# EAGLE design sensor_tag (EAGLE 9.0.0)
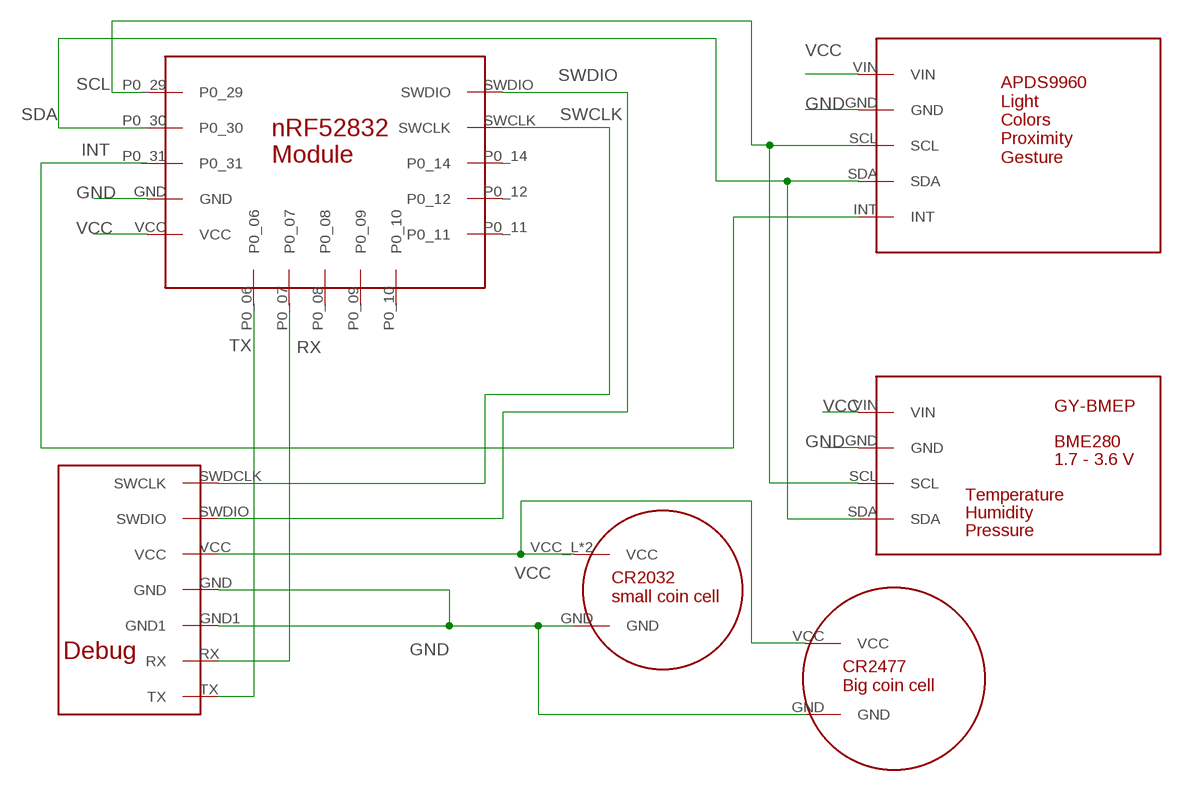
[diagram p0: schematic, sheet 1]

## Parts
U$1  GY-BMEPGY-BMEP-NOHOLE  [GY-BMEP-NOHOLE]
U$2  APDS9960_MODULEAPDS9960-FULL  [APDS9960-FULL]
U$3  NRF52832_MODULENRF52832_MOD_SMALL  [NRF52832_MOD_SMALL]
U$4  CR2032  [CR2032_SMD]
U$5  NRF_TAG_DEBUG  [NRF_TAG_DEBUG]
U$6  CR2477  [CR2477]

## Nets
GND: U$1.GND U$2.GND U$3.GND U$4.GND U$5.GND U$5.GND1 U$6.GND
INT: U$2.INT U$3.P0_31
RX: U$3.P0_07 U$5.RX
SCL: U$1.SCL U$2.SCL U$3.P0_29
SDA: U$1.SDA U$2.SDA U$3.P0_30
SWCLK: U$3.SWCLK U$5.SWDCLK(SWCLK)
SWDIO: U$3.SWDIO U$5.SWDIO
TX: U$3.P0_06 U$5.TX
VCC: U$1.VIN U$2.VIN U$3.VCC U$4.VCC_L(VCC) U$4.VCC_R(VCC) U$5.VCC U$6.VCC
Unconnected: U$3.P0_08 U$3.P0_09 U$3.P0_10 U$3.P0_11 U$3.P0_12 U$3.P0_14

## Library data of the parts
U$1 = GY-BMEP:GY-BMEP
U$2 = APDS9960:APDS9960_MODULE: This is the device for the APDS9960 module not the chip alone.
U$3 = nRF52832_module:NRF52832_MODULE
U$4 = cr2032:CR2032
U$5 = nrf_tag_debug:NRF_TAG_DEBUG
U$6 = cr2477:CR2477

## Board
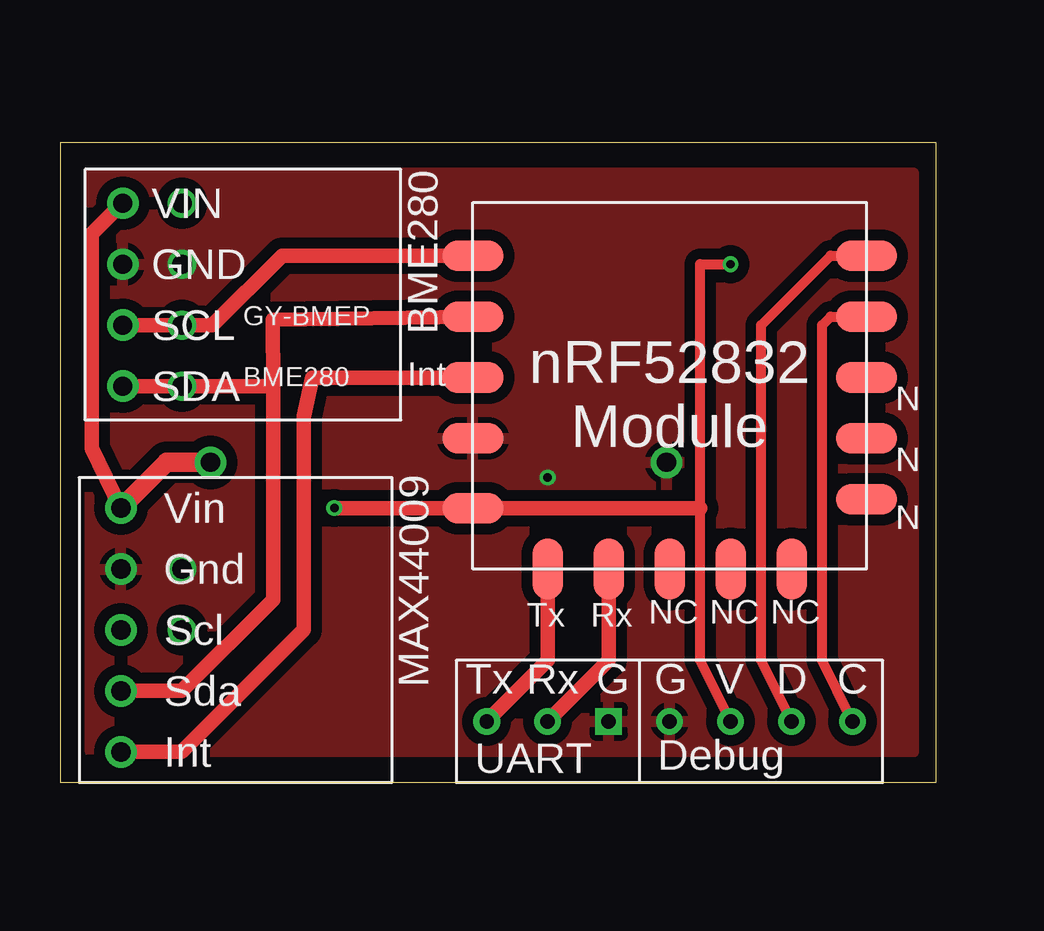
[diagram p1: board, top side]
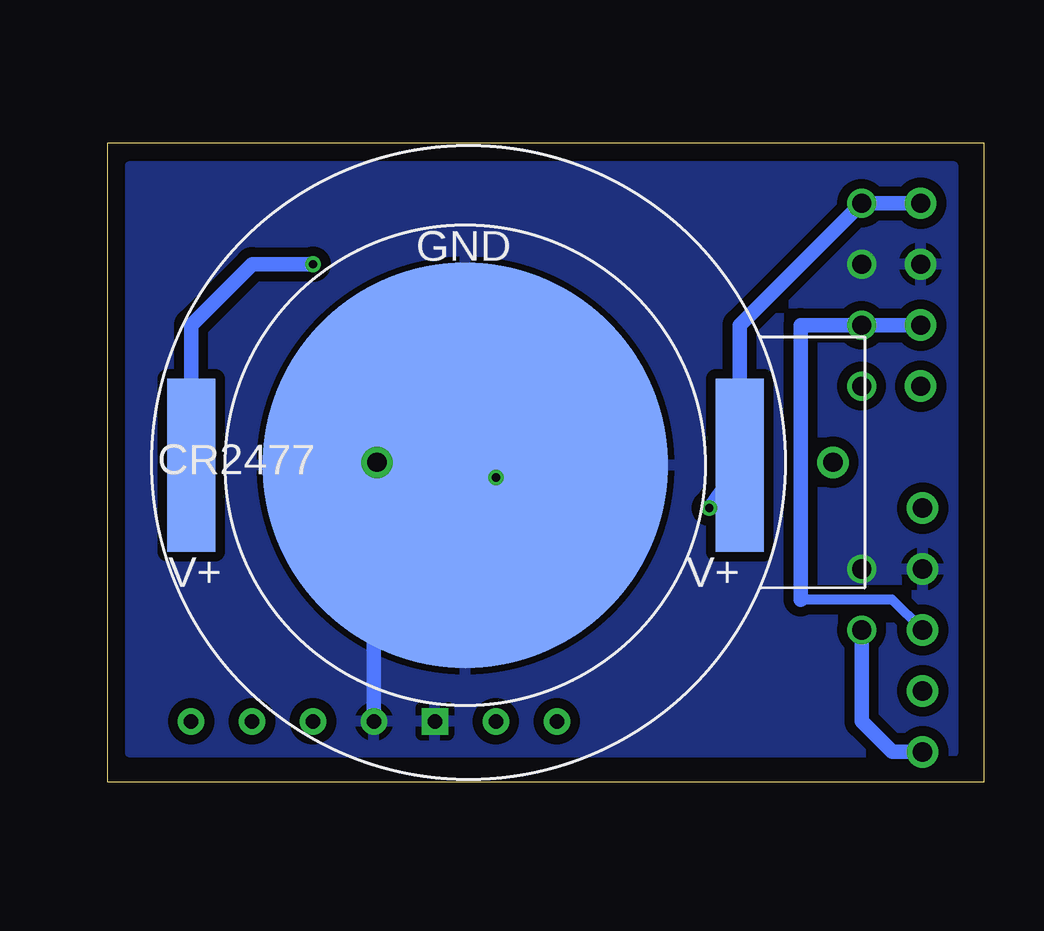
[diagram p2: board, bottom side, seen from below]

Size 36.5 x 26.66 mm. Coordinates in mm from the lower left corner, seen from the top.
Outline: 0,0 36.5,0 36.5,26.66 0,26.66 0,0
Copper layers (1*16): Top 0.035mm / dielectric 1.5mm / Bottom 0.035mm
Design rules "EagleRules": minimum track width 7mil, minimum drill 12mil, track to track 7mil, track to pad 7mil, pad to pad 7mil, via to via 7mil, smd to smd 0mil, copper to edge 20mil, drill to drill 10mil, minimum pad ring 10mil, minimum via ring 6mil, stop-mask expansion 2mil, vias tented up to drill 25mil, thermal gap 10mil

### Footprints (pad centres in the part's own frame; a part is rotated, then mirrored left to right if it is on the bottom)
GY-BMEP-NOHOLE = drill 0.8: GND -5,1.27; SCL -5,-1.27; SDA -5,-3.81; VIN -5,3.81
APDS9960-FULL = drill 0.8: GND 0,2.54; INT 0,-5.08; SCL 0,0; SDA 0,-2.54; VIN 0,5.08
NRF52832_MOD_SMALL = smd 2.54 x 1.27: GND -8.2,-3.45; P0_11 8.2,-5.99; P0_12 8.2,-3.45; P0_14 8.2,-0.91; P0_29 -8.2,4.17; P0_30 -8.2,1.63; P0_31 -8.2,-0.91; SWCLK 8.2,1.63; SWDIO 8.2,4.17; VCC -8.2,-6.35 | smd 1.27 x 2.54: P0_06 -5.08,-8.89; P0_07 -2.54,-8.89; P0_08 0,-8.89; P0_09 2.54,-8.89; P0_10 5.08,-8.89
CR2032_SMD = smd 16.9 x 16.9: GND 0,0 | smd 2 x 7.2: VCC_L -11.43,0; VCC_R 11.43,0
NRF_TAG_DEBUG = drill 0.6: GND 0,0; RX -5.08,0; SWDCLK 7.62,0; SWDIO 5.08,0; TX -7.62,0; VCC 2.54,0 | drill 0.6 square: GND1 -2.54,0
CR2477 = drill 0.8: GND 0,0; VCC 19,0

### Placement (x,y rotation side)
U$1  7.62,20.32 0 top
U$2  2.54,6.35 0 top
U$3  25.4,17.78 0 top
U$4  21.59,13.21 180 bottom
U$5  25.4,2.54 0 top
U$6  25.27,13.34 0 bottom

### Tracks (layer width: path | path; a pad name or v marks a point on that pad's centre or on a via)
GND  (via drill 0.35, 0.8)
  Bottom 0.61: U$4.GND v20.32,12.7 20.32,11.43 | U$5.GND 25.4,7.62
  other vias: 5.08,8.89 5.08,21.59
  pour Top (isolate 0.457): 1.27,25.4 35.56,25.4 35.56,1.27 1.27,1.27
  pour Bottom (isolate 0.406): 1.27,25.65 35.56,25.65 35.56,1.27 1.27,1.27
INT  (via drill 0.8)
  Top 0.61: U$3.P0_31 10.52,16.87 10.16,15.24 10.16,6.35 5.08,1.27 U$2.INT
  Bottom 0.61: U$2.INT 3.81,1.27 5.08,2.54 v5.08,6.35
RX
  Top 0.61: U$5.RX 22.86,5.08 U$3.P0_07
SCL  (via drill 0.8)
  Top 0.61: U$1.SCL v5.08,19.05 6.35,19.05 9.25,21.95 U$3.P0_29
  Bottom 0.406: U$2.SCL 3.81,7.62 7.62,7.62
  Bottom 0.61: 7.62,7.62 7.62,19.05 v5.08,19.05 U$1.SCL
SDA  (via drill 0.8)
  Top 0.61: U$2.SDA 5.08,3.81 8.89,7.62 8.89,16.51 | 2.54,16.51 U$1.SDA v5.08,16.51 8.89,16.51 | 8.89,16.51 8.87,19.28 U$3.P0_30
SWCLK
  Top 0.406: U$5.SWDCLK 31.75,5.08 31.75,19.05 32.11,19.41 U$3.SWCLK
SWDIO
  Top 0.406: U$5.SWDIO 29.21,5.08 29.21,19.05 32.11,21.95 U$3.SWDIO
TX
  Top 0.61: U$5.TX 20.32,5.08 U$3.P0_06
VCC  (via drill 0.35, 0.8)
  Top 0.406: U$5.VCC 26.67,5.08 26.67,11.43 26.67,21.59 v27.94,21.59
  Top 0.61: U$2.VIN 1.32,13.92 1.32,22.86 2.59,24.13 U$1.VIN | 26.67,11.43 U$3.VCC v11.43,11.43
  Top 0.813: U$2.VIN 4.45,13.34 U$6.VCC
  Bottom 0.61: U$4.VCC_R 33.02,19.05 30.48,21.59 v27.94,21.59 | U$1.VIN v5.08,24.13 10.16,19.05 U$4.VCC_L v11.43,11.43

### Text on the board
tPlace: BME280 | Int | N | MAX44009 | N | N | NC | NC | NC | Tx | Rx